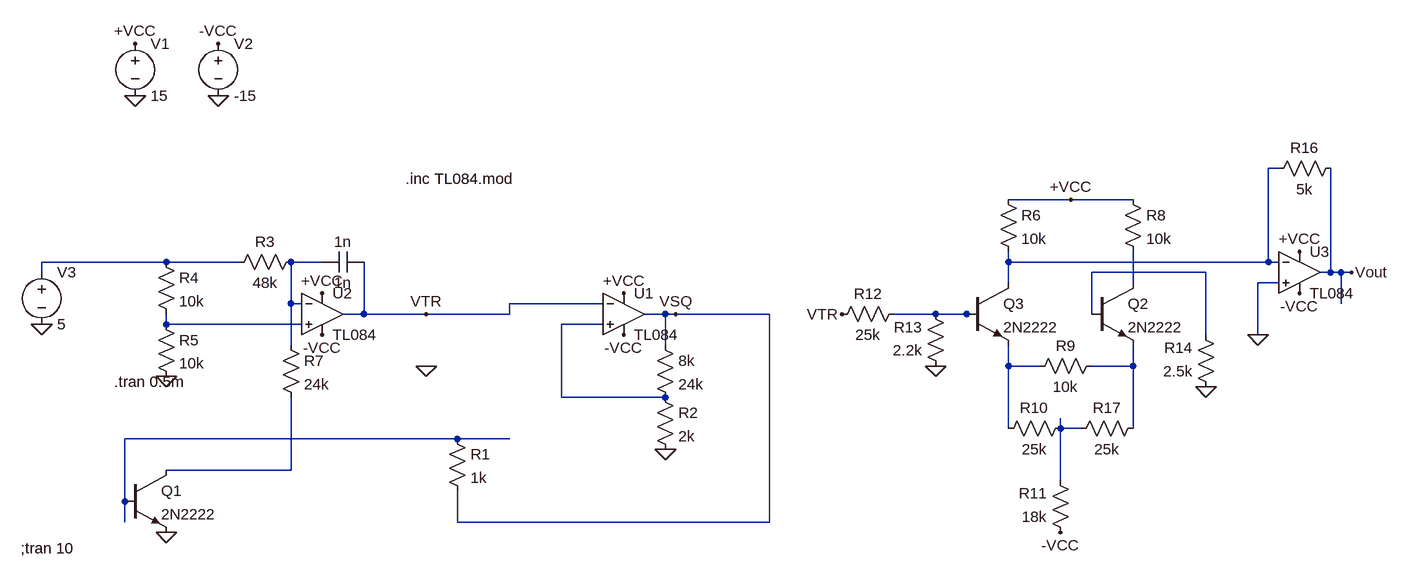
[diagram p0: schematic VCO1+converter3.asc]
VCO1+converter3.asc, the LTspice schematic file:
Version 4
SHEET 1 1496 692
WIRE 1312 32 1296 32
WIRE 992 80 896 80
WIRE 1088 80 992 80
WIRE -400 176 -592 176
WIRE -288 176 -400 176
WIRE -160 176 -208 176
WIRE 896 176 896 160
WIRE 1296 176 1296 32
WIRE 1296 176 896 176
WIRE 1312 176 1296 176
WIRE -592 192 -592 176
WIRE 1200 192 1024 192
WIRE 1392 192 1392 32
WIRE 1392 192 1376 192
WIRE 1408 192 1392 192
WIRE 1424 192 1408 192
WIRE 896 208 896 176
WIRE 1088 208 1088 160
WIRE 1312 208 1280 208
WIRE -208 240 -208 176
WIRE -192 240 -208 240
WIRE 272 240 128 240
WIRE 1408 240 1408 192
WIRE -96 256 -96 176
WIRE -96 256 -128 256
WIRE 0 256 -96 256
WIRE 128 256 128 240
WIRE 128 256 0 256
WIRE 368 256 336 256
WIRE 384 256 368 256
WIRE 528 256 384 256
WIRE 784 256 720 256
WIRE 832 256 784 256
WIRE 848 256 832 256
WIRE 1024 256 1024 192
WIRE -400 272 -400 256
WIRE -192 272 -400 272
WIRE 272 272 208 272
WIRE 1200 288 1200 192
WIRE 1280 288 1280 208
WIRE -208 304 -208 240
WIRE 368 304 368 256
WIRE 896 336 896 304
WIRE 944 336 896 336
WIRE 1088 336 1088 304
WIRE 1088 336 1024 336
WIRE 208 384 208 272
WIRE 368 384 208 384
WIRE 896 432 896 336
WIRE 976 432 976 416
WIRE 1008 432 976 432
WIRE 1088 432 1088 336
WIRE 48 448 -464 448
WIRE 128 448 48 448
WIRE -208 496 -208 384
WIRE -208 496 -400 496
WIRE 976 512 976 432
WIRE -464 544 -464 448
WIRE -464 576 -464 544
WIRE 48 576 48 528
WIRE 528 576 528 256
WIRE 528 576 48 576
FLAG 304 224 +VCC
FLAG 304 288 -VCC
FLAG -448 -160 +VCC
FLAG -320 -160 -VCC
FLAG -448 -80 0
FLAG -320 -80 0
FLAG 384 256 VSQ
FLAG -400 592 0
FLAG -592 272 0
FLAG -160 224 +VCC
FLAG -160 288 -VCC
FLAG -400 352 0
FLAG 368 464 0
FLAG 0 336 0
FLAG 0 256 VTR
FLAG 1344 160 +VCC
FLAG 1344 224 -VCC
FLAG 1424 192 Vout
FLAG 784 336 0
FLAG 1200 368 0
FLAG 1280 288 0
FLAG 640 256 VTR
FLAG 992 80 +VCC
FLAG 976 592 -VCC
SYMBOL Opamps\\opamp2 304 192 R0
SYMATTR InstName U1
SYMATTR Value TL084
SYMBOL voltage -448 -176 R0
WINDOW 123 0 0 Left 0
WINDOW 39 0 0 Left 0
SYMATTR InstName V1
SYMATTR Value 15
SYMBOL voltage -320 -176 R0
WINDOW 123 0 0 Left 0
WINDOW 39 0 0 Left 0
SYMATTR InstName V2
SYMATTR Value -15
SYMBOL Opamps\\opamp2 -160 192 R0
SYMATTR InstName U2
SYMATTR Value TL084
SYMBOL cap -96 160 R90
WINDOW 0 0 32 VBottom 2
WINDOW 3 32 32 VTop 2
SYMATTR InstName 1n
SYMATTR Value 1n
SYMBOL res -192 160 R90
WINDOW 0 0 56 VBottom 2
WINDOW 3 32 56 VTop 2
SYMATTR InstName R3
SYMATTR Value 48k
SYMBOL res -416 160 R0
SYMATTR InstName R4
SYMATTR Value 10k
SYMBOL res -416 256 R0
SYMATTR InstName R5
SYMATTR Value 10k
SYMBOL voltage -592 176 R0
WINDOW 123 0 0 Left 0
WINDOW 39 0 0 Left 0
SYMATTR InstName V3
SYMATTR Value 5
SYMBOL res -224 288 R0
SYMATTR InstName R7
SYMATTR Value 24k
SYMBOL res 352 288 R0
SYMATTR InstName 8k
SYMATTR Value 24k
SYMBOL res 352 368 R0
SYMATTR InstName R2
SYMATTR Value 2k
SYMBOL res 32 432 R0
SYMATTR InstName R1
SYMATTR Value 1k
SYMBOL npn -464 496 R0
SYMATTR InstName Q1
SYMATTR Value 2N2222
SYMBOL res 880 64 R0
SYMATTR InstName R6
SYMATTR Value 10k
SYMBOL res 1072 64 R0
SYMATTR InstName R8
SYMATTR Value 10k
SYMBOL res 1040 320 R90
WINDOW 0 0 56 VBottom 2
WINDOW 3 32 56 VTop 2
SYMATTR InstName R9
SYMATTR Value 10k
SYMBOL res 992 416 R90
WINDOW 0 0 56 VBottom 2
WINDOW 3 32 56 VTop 2
SYMATTR InstName R10
SYMATTR Value 25k
SYMBOL res 992 608 R180
WINDOW 0 36 76 Left 2
WINDOW 3 36 40 Left 2
SYMATTR InstName R11
SYMATTR Value 18k
SYMBOL npn 1024 208 R0
SYMATTR InstName Q2
SYMATTR Value 2N2222
SYMBOL npn 832 208 R0
SYMATTR InstName Q3
SYMATTR Value 2N2222
SYMBOL res 736 240 R90
WINDOW 0 0 56 VBottom 2
WINDOW 3 32 56 VTop 2
SYMATTR InstName R12
SYMATTR Value 25k
SYMBOL res 800 352 R180
WINDOW 0 36 76 Left 2
WINDOW 3 36 40 Left 2
SYMATTR InstName R13
SYMATTR Value 2.2k
SYMBOL res 1216 384 R180
WINDOW 0 36 76 Left 2
WINDOW 3 36 40 Left 2
SYMATTR InstName R14
SYMATTR Value 2.5k
SYMBOL Opamps\\opamp2 1344 128 R0
SYMATTR InstName U3
SYMATTR Value TL084
SYMBOL res 1408 16 R90
WINDOW 0 0 56 VBottom 2
WINDOW 3 32 56 VTop 2
SYMATTR InstName R16
SYMATTR Value 5k
SYMBOL res 1104 416 R90
WINDOW 0 0 56 VBottom 2
WINDOW 3 32 56 VTop 2
SYMATTR InstName R17
SYMATTR Value 25k
TEXT -32 48 Left 2 !.inc TL084.mod
TEXT -480 360 Left 2 !.tran 0.5m
TEXT -624 616 Left 2 !;tran 10

The netlist it stands for:
* VCO1+converter3.asc
XU1 N008 VTR +VCC -VCC VSQ TL084  ; pins In+ In- V+ V- OUT
V1 +VCC 0 15
V2 -VCC 0 -15
XU2 N007 N003 +VCC -VCC VTR TL084  ; pins In+ In- V+ V- OUT
C§1n VTR N003 1n
R3 N003 N002 48k
R4 N002 N007 10k
R5 N007 0 10k
V3 N002 0 5
R7 N003 N013 24k
R§8k VSQ N008 24k
R2 N008 0 2k
R1 N012 VSQ 1k
Q1 N013 N012 0 0 2N2222
R6 +VCC N001 10k
R8 +VCC N005 10k
R9 N010 N009 10k
R10 N011 N009 25k
R11 -VCC N011 18k
Q2 N005 N004 N010 0 2N2222
Q3 N001 N006 N009 0 2N2222
R12 N006 VTR 25k
R13 0 N006 2.2k
R14 0 N004 2.5k
XU3 0 N001 +VCC -VCC Vout TL084  ; pins In+ In- V+ V- OUT
R16 Vout N001 5k
R17 N010 N011 25k
.model NPN NPN
.model PNP PNP
.lib standard.bjt
.inc TL084.mod
.tran 0.5m
;tran 10
.backanno
.end